# EasyEDA Pro project U-blox ZED F9P定位模块 差分GPS RTK定位.epro

# Schematic Schematic1

## Sheets
1 P1_GPS_F9P: Create Date: 2023-11-30; Page Name: P1; Project Name: U-blox ZED F9P定位模块 差分GPS RTK定位; Schematic Name: Schematic1; Update Date: 2023-11-30; Company: 嘉立创EDA; Page Size: A4; Version: V1.0
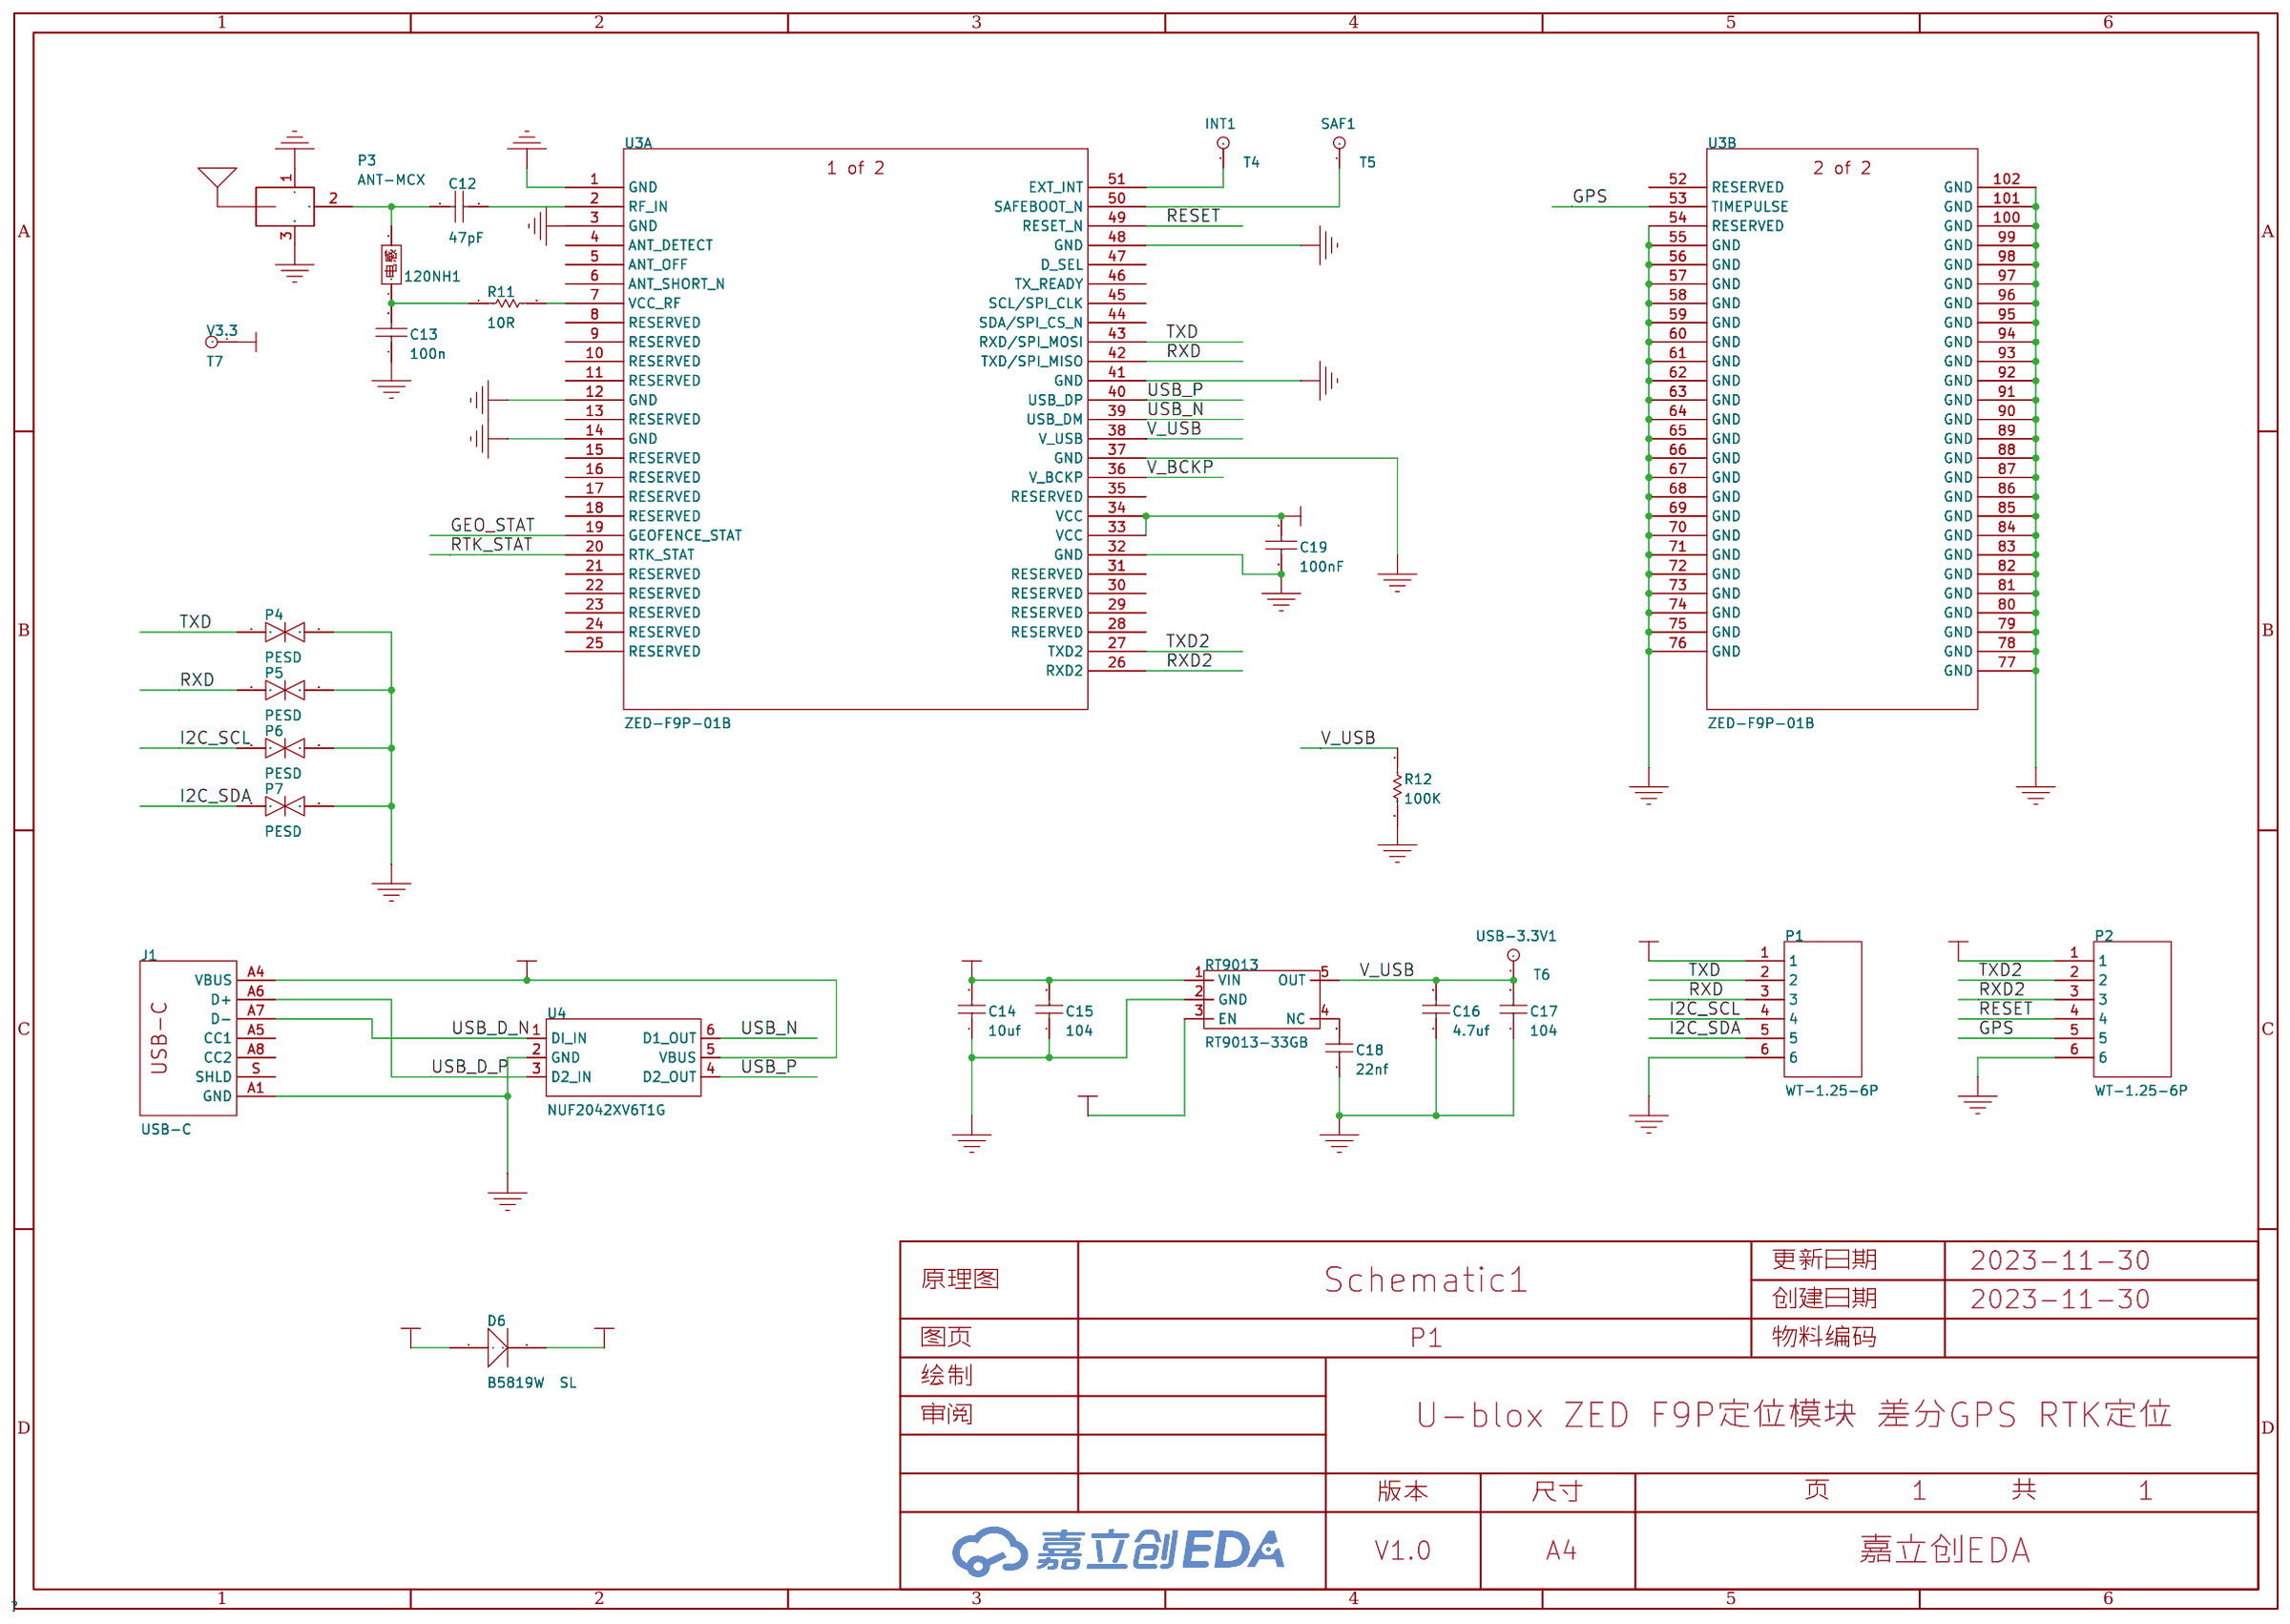
[diagram p0: P1_GPS_F9P]
2 P2_Power: Page Name: P2_Power
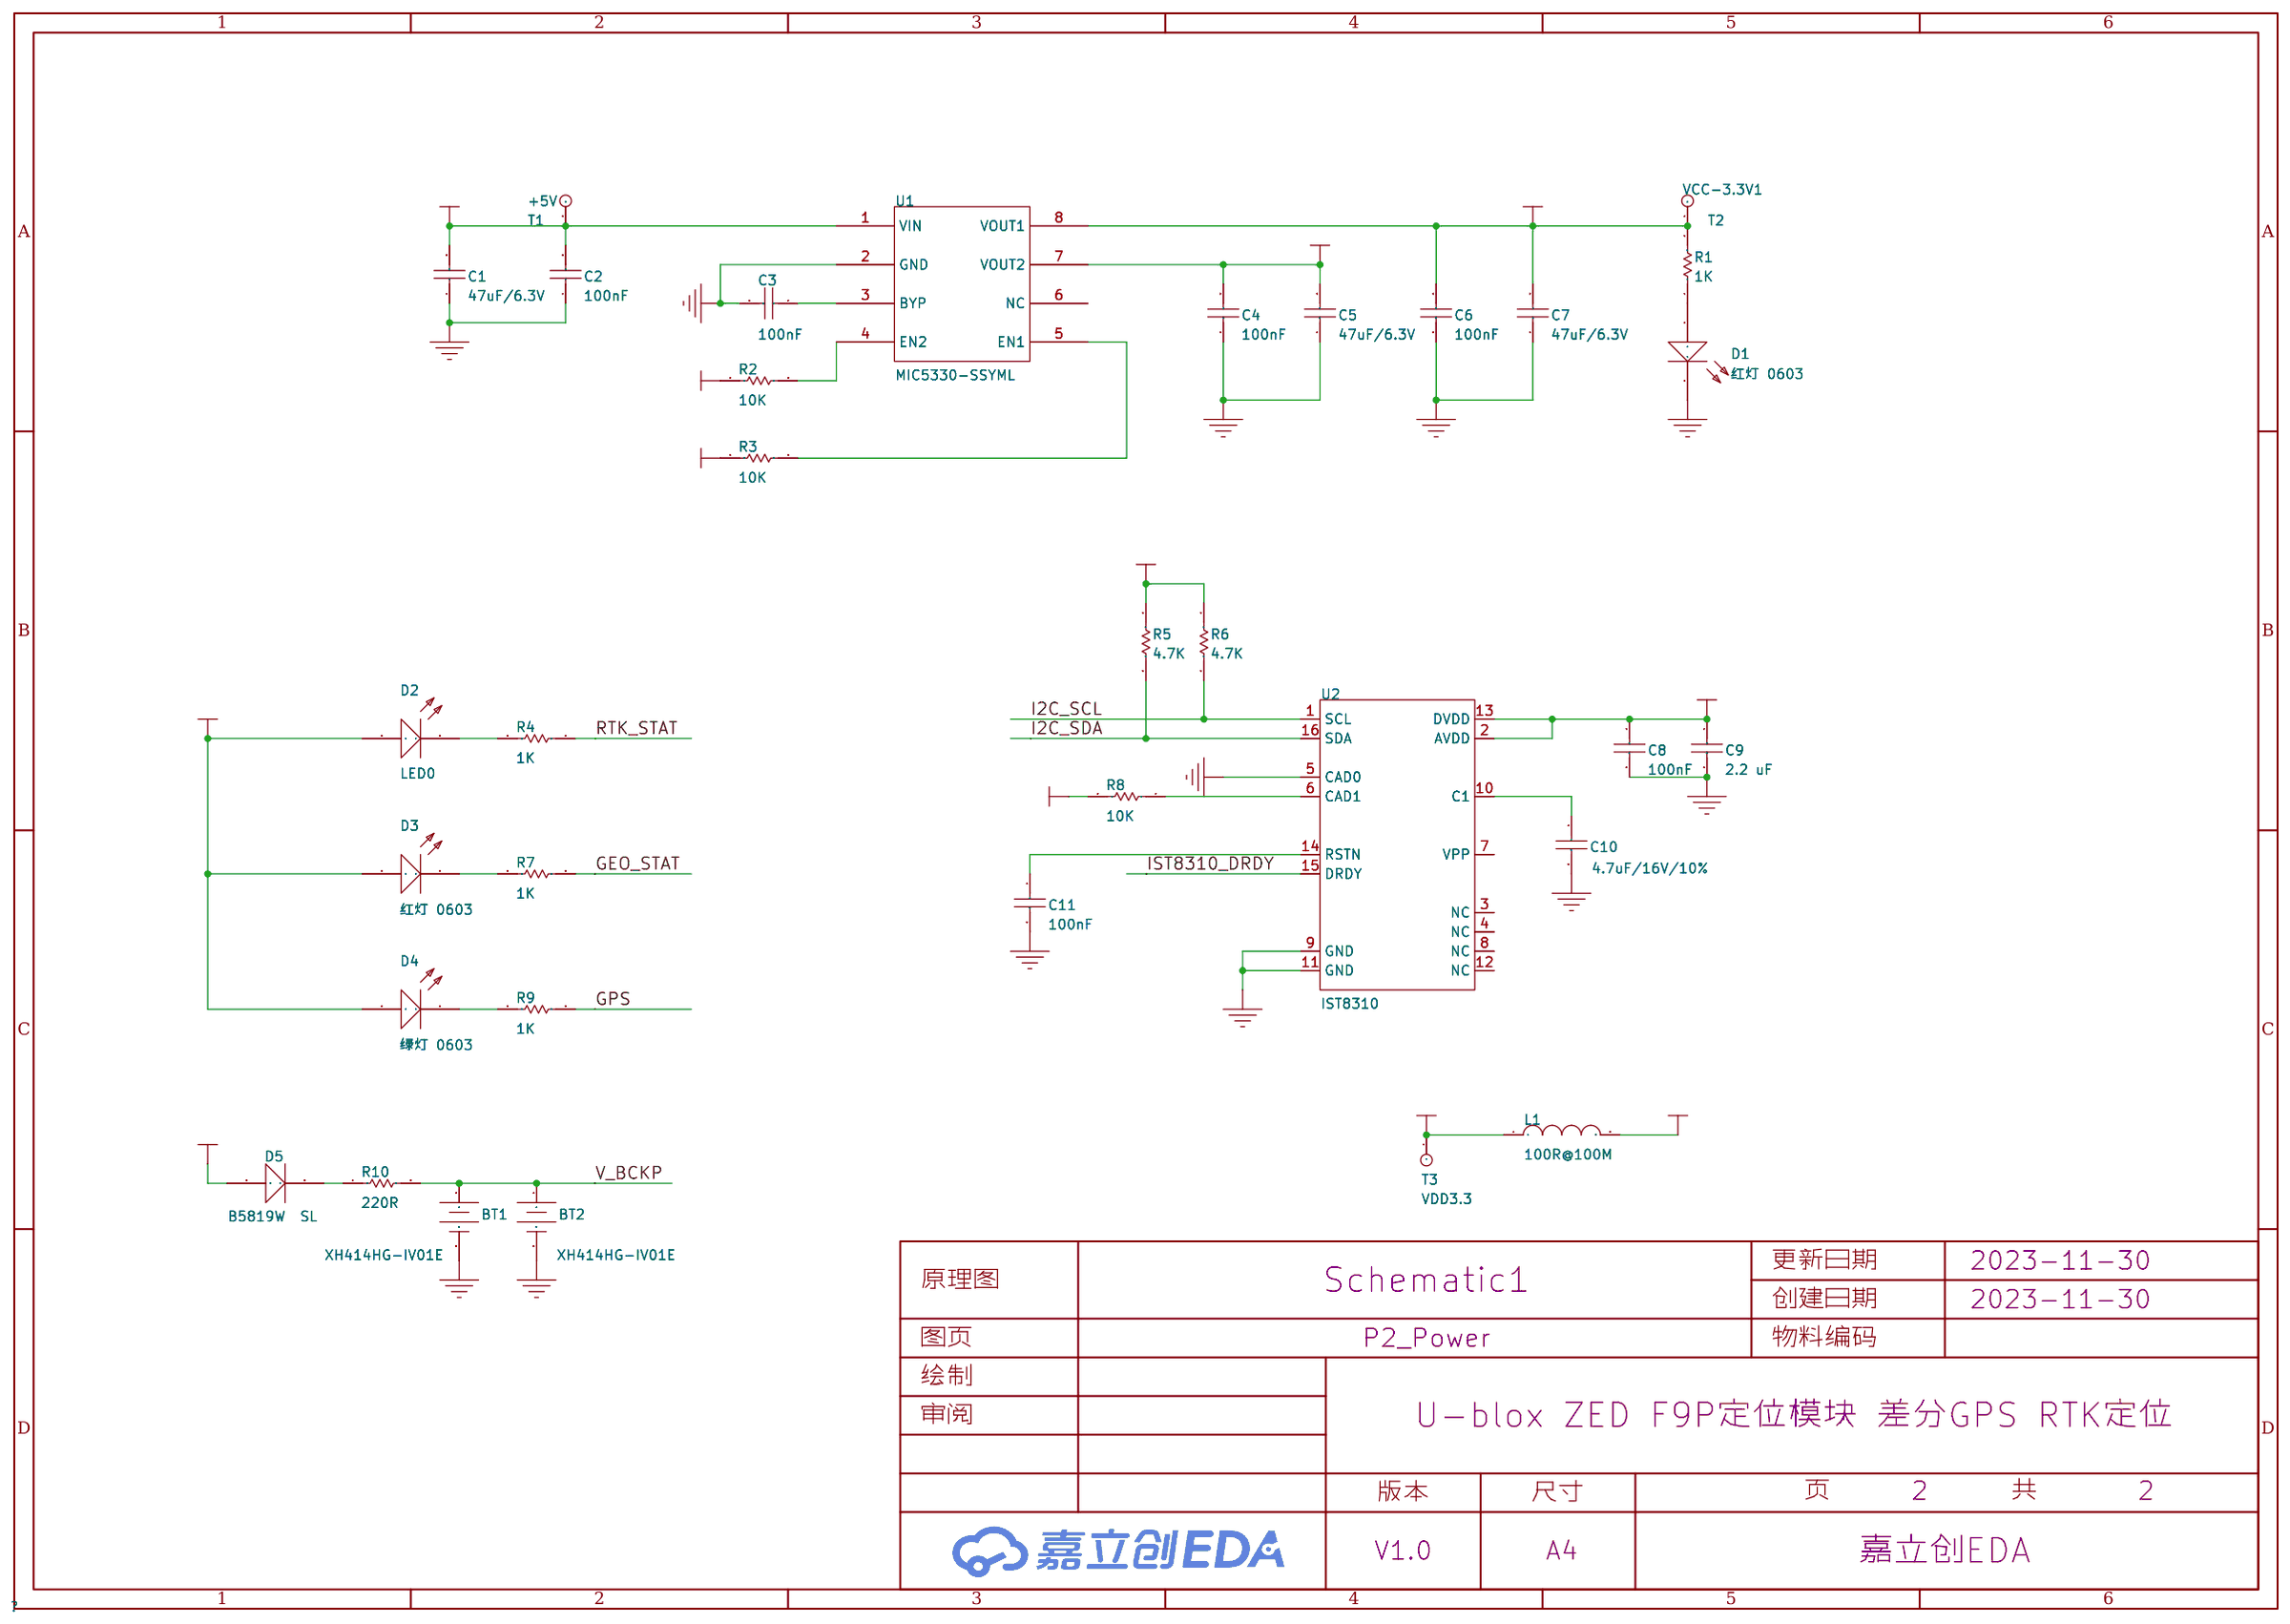
[diagram p1: P2_Power]

## Parts
sheet P1_GPS_F9P
120NH1  L  [0402R]
C12  100pF  [0402c]
C13  100pF  [0402c]
C14  10uf  [0603C]
C15  104  [0402c]
C16  4.7uf  [0603C]
C17  104  [0402c]
C18  22nf  [0402c]
C19  100pF  [0402c]
D6  B5819W  SL  [SOD-123]
INT1  T4  [TP]
J1  USB-C  [USB-Type-C]
P1  WT-1.25-6P  [GH-1.25-6P]
P2  WT-1.25-6P  [GH-1.25-6P]
P3  ANT-MCX  [ANT-MCX]
P4  PESD  [PESD0402]
P5  PESD  [PESD0402]
P6  PESD  [PESD0402]
P7  PESD  [PESD0402]
R11  1K  [0402R]
R12  1K  [0402R]
RT9013  RT9013-33GB  [SOT23-5L]
SAF1  T5  [TP]
U3  ZED-F9P-01B  [ZED-F9P-01B_UBL]  (sections 1,2)
U4  NUF2042XV6T1G  [SOT-563-6]
USB-3.3V1  T6  [TP]
V3.3  T7  [TP]
sheet P2_Power
BT1  XH414HG-IV01E  [XH414HG-IV01E]
BT2  XH414HG-IV01E  [XH414HG-IV01E]
C1  100pF  [0805C]
C2  100pF  [0402c]
C3  100pF  [0402c]
C4  100pF  [0402c]
C5  100pF  [0805C]
C6  100pF  [0402c]
C7  100pF  [0805C]
C8  100pF  [0402c]
C9  100pF  [0603C]
C10  100pF  [0603C]
C11  100pF  [0402c]
D1  红灯 0603  [0603_LED_S1]
D2  LED0  [0603D]
D3  红灯 0603  [0603_LED_S1]
D4  绿灯 0603  [0603_LED_S1]
D5  B5819W  SL  [SOD-123]
L1  10mH  [0603L]
R1  1K  [0402R]
R2  1K  [0402R]
R3  1K  [0402R]
R4  1K  [0402R]
R5  1K  [0402R]
R6  1K  [0402R]
R7  1K  [0402R]
R8  1K  [0402R]
R9  1K  [0402R]
R10  1K  [0402R]
T1  +5V  [TP]
T3  VDD3.3  [TP]
U1  MIC5330-SSYML  [MIC5330-SSYML-TR]
U2  IST8310  [LGA16-ITS8310]
VCC-3.3V1  T2  [TP]

## Library data of the parts
120NH1 = L: Library Name: Schlib1
C12 = 47pF: Capacitor; Published: 8-Jun-2000; LatestRevisionDate: 17-Jul-2002; LatestRevisionNote: Re-released for DXP Platform.; PackageReference: RAD-0.3; Publisher: Altium Limited; PackageDescription: Radial Cap, Thru-Hole; 2 Leads; 0.3 in Pin Spacing; Design Item ID: Cap; Library Name: Miscellaneous Devices
C13 = 100n: Capacitor; Published: 8-Jun-2000; LatestRevisionDate: 17-Jul-2002; LatestRevisionNote: Re-released for DXP Platform.; PackageReference: RAD-0.3; Publisher: Altium Limited; PackageDescription: Radial Cap, Thru-Hole; 2 Leads; 0.3 in Pin Spacing; Design Item ID: Cap; Library Name: Miscellaneous Devices
C14 = 10uf: 无极性电容; Design Item ID: CAP; Library Name: H750_CORE
C15 C17 = 104: 无极性电容; Design Item ID: CAP; Library Name: H750_CORE
C16 = 4.7uf: 无极性电容; Design Item ID: CAP; Library Name: H750_CORE
C18 = 22nf: 无极性电容; Design Item ID: CAP; Library Name: H750_CORE
C2-C4 C6 C8 C11 C19 = 100nF: Capacitor; Published: 8-Jun-2000; LatestRevisionDate: 17-Jul-2002; LatestRevisionNote: Re-released for DXP Platform.; PackageReference: RAD-0.3; Publisher: Altium Limited; PackageDescription: Radial Cap, Thru-Hole; 2 Leads; 0.3 in Pin Spacing; Origin Footprint 2: 0603C; Design Item ID: Cap; Library Name: Miscellaneous Devices
D5 D6 = B5819W  SL: 肖特基二极管; ComponentLink1Description: 供应商链接; ComponentLink1URL: http://www.szlcsc.com/product/details_9093.html; Supplier: LC; SuppliersPartNumber: C8598; Design Item ID: SOD-123 B5819W  SL; Library Name: Miscellaneous Devices LC
INT1 = T4: Library Name: Schlib1
J1 = USB-C: Design Item ID: USB3.1; Library Name: Schlib1
P1 P2 = WT-1.25-6P: Library Name: Schlib1
P3 = ANT-MCX: Design Item ID: ANT; Library Name: Schlib1
P4-P7 = PESD: PESD 0402; Library Name: Schlib1
R11 = 10R: Resistor; Published: 8-Jun-2000; LatestRevisionDate: 17-Jul-2002; LatestRevisionNote: Re-released for DXP Platform.; PackageReference: AXIAL-0.3; Publisher: Altium Limited; PackageDescription: Axial Device, Thru-Hole; 2 Leads; 0.3 in Pin Spacing; Design Item ID: Res1; Library Name: Miscellaneous Devices
R12 = 100K: Resistor; Published: 8-Jun-2000; LatestRevisionDate: 17-Jul-2002; LatestRevisionNote: Re-released for DXP Platform.; PackageReference: AXIAL-0.3; Publisher: Altium Limited; PackageDescription: Axial Device, Thru-Hole; 2 Leads; 0.3 in Pin Spacing; Design Item ID: Res1; Library Name: Miscellaneous Devices
RT9013 = RT9013-33GB: 3.3V 500mA LDO; Library Name: Schlib1
SAF1 = T5: Library Name: Schlib1
U3 = ZED-F9P-01B: 多频 GNSS 接收机; Copyright: Copyright (C) 2022 Ultra Librarian. All rights reserved.; Mfr_Name: Ublox; Manufacturer_Part_Number: ZED-F9R-01B; Type: DEV; Library Name: Schlib1
U4 = NUF2042XV6T1G: Library Name: Schlib1
USB-3.3V1 = T6: Library Name: Schlib1
V3.3 = T7: Library Name: Schlib1
BT1 BT2 = XH414HG-IV01E: Design Item ID: Battery; Library Name: Schlib1
C1 C5 C7 = 47uF/6.3V: Capacitor; Published: 8-Jun-2000; LatestRevisionDate: 17-Jul-2002; LatestRevisionNote: Re-released for DXP Platform.; PackageReference: RAD-0.3; Publisher: Altium Limited; PackageDescription: Radial Cap, Thru-Hole; 2 Leads; 0.3 in Pin Spacing; Origin Footprint 2: 1206C; Design Item ID: Cap; Library Name: Miscellaneous Devices
C9 = 2.2 uF: Capacitor; Published: 8-Jun-2000; LatestRevisionDate: 17-Jul-2002; LatestRevisionNote: Re-released for DXP Platform.; PackageReference: RAD-0.3; Publisher: Altium Limited; PackageDescription: Radial Cap, Thru-Hole; 2 Leads; 0.3 in Pin Spacing; Design Item ID: Cap; Library Name: Miscellaneous Devices
C10 = 4.7uF/16V/10%: Capacitor; Published: 8-Jun-2000; LatestRevisionDate: 17-Jul-2002; LatestRevisionNote: Re-released for DXP Platform.; PackageReference: RAD-0.3; Publisher: Altium Limited; PackageDescription: Radial Cap, Thru-Hole; 2 Leads; 0.3 in Pin Spacing; Design Item ID: Cap; Library Name: Miscellaneous Devices
D1 D3 = 红灯 0603: 发光二极管; ComponentLink1Description: 供应商链接; ComponentLink1URL: http://www.szlcsc.com/product/details_2659.html; Supplier: LC; SuppliersPartNumber: C2286; Design Item ID: 0603 红灯; Library Name: Miscellaneous Devices LC
D2 = LED0: Typical INFRARED GaAs LED; Published: 8-Jun-2000; LatestRevisionDate: 08-Jul-2005; LatestRevisionNote: Mech Layer 1 removed.; PackageReference: LED-0; Publisher: Altium Limited; PackageDescription: LED; 2 Leads; Library Name: Miscellaneous Devices
D4 = 绿灯 0603: 发光二极管; ComponentLink1Description: 供应商链接; ComponentLink1URL: http://www.szlcsc.com/product/details_73152.html; Supplier: LC; SuppliersPartNumber: C72043; Design Item ID: 0603 绿灯; Library Name: Miscellaneous Devices LC
L1 = 100R@100M: Inductor; Published: 8-Jun-2000; LatestRevisionDate: 29-May-2009; LatestRevisionNote: IPC-7351 Footprint Added.; PackageReference: 0402-A; Publisher: Altium Limited; PackageDescription: Chip Inductor; Code_JEITA: 0402; Code_IEC: 1005; Design Item ID: Inductor; Library Name: Miscellaneous Devices
R1 R4 = 1K: Resistor; Published: 8-Jun-2000; LatestRevisionDate: 17-Jul-2002; LatestRevisionNote: Re-released for DXP Platform.; PackageReference: AXIAL-0.3; Publisher: Altium Limited; PackageDescription: Axial Device, Thru-Hole; 2 Leads; 0.3 in Pin Spacing; Design Item ID: Res1; Library Name: Miscellaneous Devices
R2 R3 R8 = 10K: Resistor; Published: 8-Jun-2000; LatestRevisionDate: 17-Jul-2002; LatestRevisionNote: Re-released for DXP Platform.; PackageReference: AXIAL-0.3; Publisher: Altium Limited; PackageDescription: Axial Device, Thru-Hole; 2 Leads; 0.3 in Pin Spacing; Design Item ID: Res1; Library Name: Miscellaneous Devices
R5 R6 = 4.7K: Resistor; Published: 8-Jun-2000; LatestRevisionDate: 17-Jul-2002; LatestRevisionNote: Re-released for DXP Platform.; PackageReference: AXIAL-0.3; Publisher: Altium Limited; PackageDescription: Axial Device, Thru-Hole; 2 Leads; 0.3 in Pin Spacing; Design Item ID: Res1; Library Name: Miscellaneous Devices
R7 R9 = 1K: Resistor; Published: 8-Jun-2000; LatestRevisionDate: 17-Jul-2002; LatestRevisionNote: Re-released for DXP Platform.; PackageReference: AXIAL-0.3; Publisher: Altium Limited; PackageDescription: Axial Device, Thru-Hole; 2 Leads; 0.3 in Pin Spacing; Design Item ID: Res1; Library Name: Miscellaneous Devices; Origin Footprint 2: 0603R
R10 = 220R: Resistor; Published: 8-Jun-2000; LatestRevisionDate: 17-Jul-2002; LatestRevisionNote: Re-released for DXP Platform.; PackageReference: AXIAL-0.3; Publisher: Altium Limited; PackageDescription: Axial Device, Thru-Hole; 2 Leads; 0.3 in Pin Spacing; Design Item ID: Res1; Library Name: Miscellaneous Devices
T1 = +5V: Library Name: fly_controler
T3 = VDD3.3: Library Name: Schlib1
U1 = MIC5330-SSYML: Origin Footprint 2: MLF-8; Library Name: fly_controler
U2 = IST8310: Origin Footprint 2: QFN-16; Library Name: fly_controler
VCC-3.3V1 = T2: Library Name: Schlib1

## Nets
GND: BT1.2 BT2.2 C1.1 C2.1 C3.2 C4.1 C5.1 C6.1 C7.1 C8.2 C9.2 C10.2 C11.2 C13.1 C14.1 C15.1 C16.1 C17.1 C18.1 C19.2 D1.K J1.A1(GND) P1.6 P2.6 P3.1 P3.3 P4.2 P5.2 P6.2 P7.2 R12.2 RT9013.2(GND) U1.2(GND) U2.5(CAD0) U2.9(GND) U2.11(GND) U3.1(GND) U3.3(GND) U3.12(GND) U3.14(GND) U3.32(GND) U3.37(GND) U3.41(GND) U3.48(GND) U3.54(RESERVED) U3.55(GND) U3.56(GND) U3.57(GND) U3.58(GND) U3.59(GND) U3.60(GND) U3.61(GND) U3.62(GND) U3.63(GND) U3.64(GND) U3.65(GND) U3.66(GND) U3.67(GND) U3.68(GND) U3.69(GND) U3.70(GND) U3.71(GND) U3.72(GND) U3.73(GND) U3.74(GND) U3.75(GND) U3.76(GND) U3.77(GND) U3.78(GND) U3.79(GND) U3.80(GND) U3.81(GND) U3.82(GND) U3.83(GND) U3.84(GND) U3.85(GND) U3.86(GND) U3.87(GND) U3.88(GND) U3.89(GND) U3.90(GND) U3.91(GND) U3.92(GND) U3.93(GND) U3.94(GND) U3.95(GND) U3.96(GND) U3.97(GND) U3.98(GND) U3.99(GND) U3.100(GND) U3.101(GND) U3.102(GND) U4.2(GND)
VBUS: C14.2 C15.2 D6.1(A) J1.A4(VBUS) RT9013.1(VIN) U4.5(VBUS)
VCC_3V3: C6.2 C7.2 C19.1 D2.1(A) D3.A D4.A R1.2 R2.1 RT9013.3(EN) U1.8(VOUT1) U3.33(VCC) U3.34(VCC) V3.3.1 VCC-3.3V1.1
VDD_3V3: C4.2 C5.2 D5.1(A) L1.1 T3.1 U1.7(VOUT2)
VDD_5V_IN: C1.2 C2.2 D6.2(K) P1.1 P2.1 R3.1 T1.1 U1.1(VIN)
GEO_STAT: R7.2 U3.19(GEOFENCE_STAT)
GPS: P2.5 R9.2 U3.53(TIMEPULSE)
I2C_SCL: P1.4 P6.1 R6.2 U2.1(SCL)
I2C_SDA: P1.5 P7.1 R5.2 U2.16(SDA)
IST8310_DRDY: U2.15(DRDY)
RESET: P2.4 U3.49(RESET_N)
RTK_STAT: R4.1 U3.20(RTK_STAT)
RXD: P1.3 P5.1 U3.42(TXD/SPI_MISO)
RXD2: P2.3 U3.26(RXD2)
SEN_3V3: C8.1 C9.1 L1.2 R5.1 R6.1 R8.2 U2.2(AVDD) U2.13(DVDD)
TXD: P1.2 P4.1 U3.43(RXD/SPI_MOSI)
TXD2: P2.2 U3.27(TXD2)
USB_D_N: J1.A7(D-) U4.1(DI_IN)
USB_D_P: J1.A6(D+) U4.3(D2_IN)
USB_N: U3.39(USB_DM) U4.6(D1_OUT)
USB_P: U3.40(USB_DP) U4.4(D2_OUT)
V_BCKP: BT1.1 BT2.1 R10.2 U3.36(V_BCKP)
V_USB: C16.2 C17.2 R12.1 RT9013.5(OUT) U3.38(V_USB) USB-3.3V1.1
Net-(120NH1-1): 120NH1.1 C13.2 R11.1
Net-(120NH1-2): 120NH1.2 C12.1 P3.2
Net-(INT1-1): INT1.1 U3.51(EXT_INT)
Net-(SAF1-1): SAF1.1 U3.50(SAFEBOOT_N)
NETC3_1: C3.1 U1.3(BYP)
NETC10_1: C10.1 U2.10(C1)
NETC11_1: C11.1 U2.14(RSTN)
NETC12_2: C12.2 U3.2(RF_IN)
NETC18_2: C18.2 RT9013.4(NC)
NETD1_A: D1.A R1.1
NETD2_2: D2.2(K) R4.2
NETD3_K: D3.K R7.1
NETD4_K: D4.K R9.1
NETD5_2: D5.2(K) R10.1
NETR2_2: R2.2 U1.4(EN2)
NETR3_2: R3.2 U1.5(EN1)
NETR8_1: R8.1 U2.6(CAD1)
NETR11_2: R11.2 U3.7(VCC_RF)

Not connected (* = marked no-connect by the designer): J1 A5(CC1) A8(CC2) S(SHLD); U1 6(NC); U2 3(NC) 4(NC) 7(VPP) 8(NC) 12(NC); U3 4(ANT_DETECT) 5(ANT_OFF) 6(ANT_SHORT_N) 8(RESERVED) 9(RESERVED) 10(RESERVED) 11(RESERVED) 13(RESERVED) 15(RESERVED) 16(RESERVED) 17(RESERVED) 18(RESERVED) 21(RESERVED) 22(RESERVED) 23(RESERVED) 24(RESERVED) 25(RESERVED) 28(RESERVED) 29(RESERVED) 30(RESERVED) 31(RESERVED) 35(RESERVED) 44(SDA/SPI_CS_N) 45(SCL/SPI_CLK) 46(TX_READY) 47(D_SEL) 52(RESERVED)

# Board PCB1
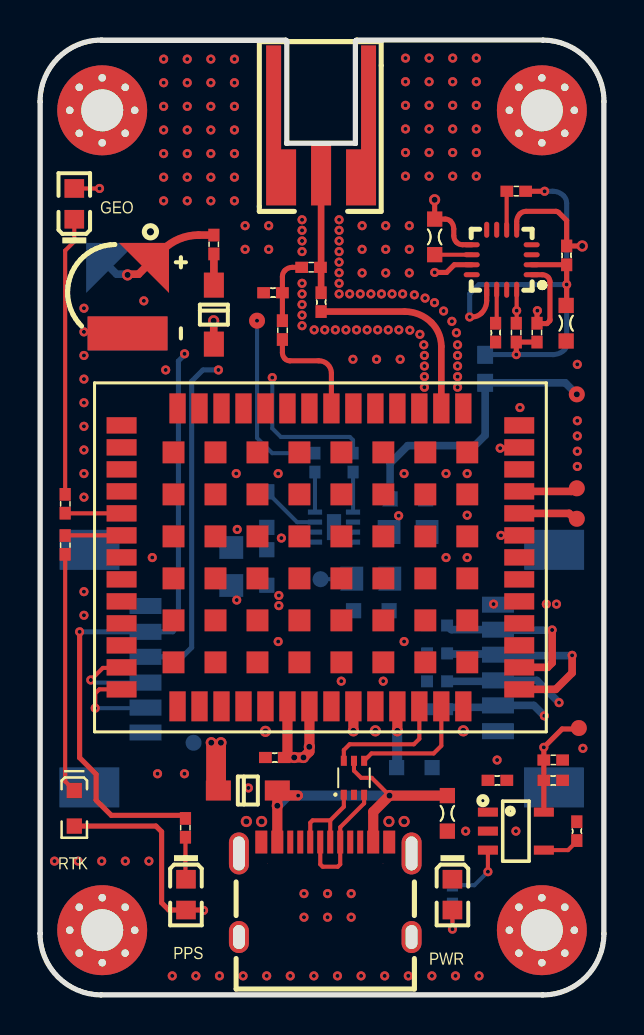
[diagram p2: board, top side]
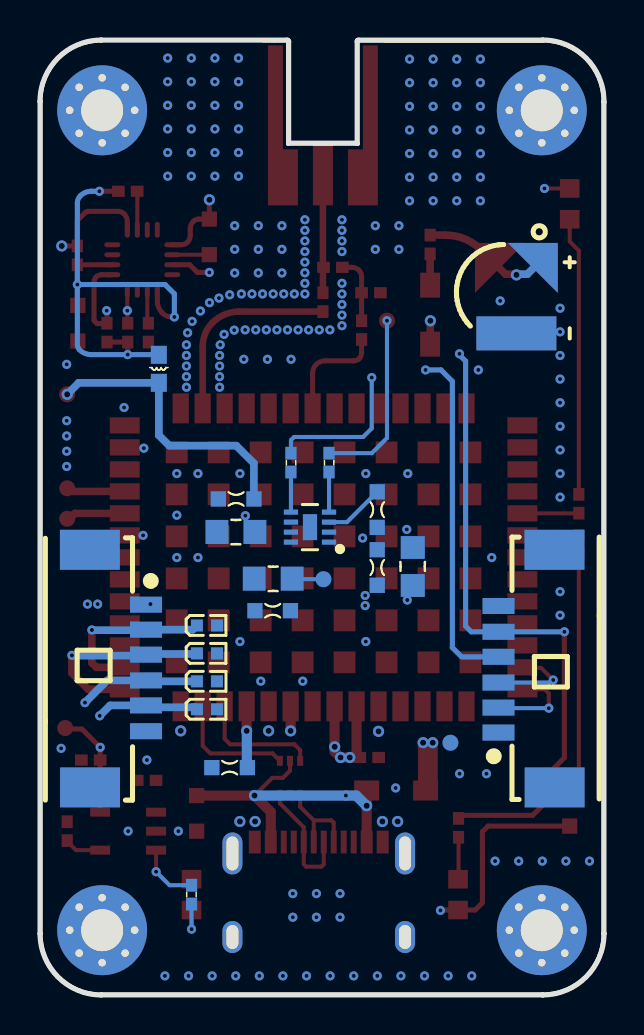
[diagram p3: board, bottom side, seen from below]

Outline 28.23 x 47.76 mm; copper layers: Top Layer, GND, Power, Bottom Layer. Coordinates in mm from the lower left corner of the outline.
Outline path: 0,3.07 0,3.09 ; 0,3.07 arc(0,3.08) 0,3.09 ; 0,3.07 arc(0.9,0.9) 3.06,0 arc(3.07,0) 3.07,0 25.14,0 arc(25.15,0) 25.16,0 arc(27.33,0.9) 28.22,3.06 arc(28.22,3.07) 28.22,3.07 28.22,44.67 arc(28.23,44.68) 28.23,44.69 arc(27.33,46.86) 25.16,47.76 arc(25.16,47.76) 25.16,47.76 15.86,47.76 arc(15.83,47.75) 15.81,47.74 15.8,47.72 arc(15.78,47.7) 15.78,47.68 15.78,42.6 12.36,42.6 12.36,47.68 arc(12.35,47.71) 12.34,47.73 12.33,47.74 arc(12.31,47.75) 12.28,47.76 3.09,47.76 arc(3.08,47.76) 3.07,47.76 arc(0.9,46.86) 0,44.69 arc(0,44.68) 0.01,44.67 arc(0,44.66) 0,44.64 0,3.09 ; 0.07,44.69 arc(0.95,46.82) 3.07,47.69 ; 0.07,3.07 0.07,44.64 ; 25.16,0.07 3.06,0.07 arc(0.94,0.95) 0.06,3.07 ; 10.99,47.69 3.07,47.69 12.28,47.69 12.29,47.68 12.29,42.54 15.84,42.54 15.84,47.68 15.86,47.69 17.09,47.69 ; 25.16,47.69 arc(27.28,46.81) 28.16,44.69 ; 28.16,44.69 28.16,3.06 ; 28.16,3.06 arc(27.28,0.94) 25.16,0.06
Stack: Top Layer 0.035mm / Dielectric1 1.51mm FR4 er 4.5 / GND 0.035mm / Dielectric2 0.48mm PP er 4.5 / Power 0.035mm / Dielectric3 0.48mm PP er 4.5 / Bottom Layer 0.035mm

## Design rules (mm)
template: JLCPCB Capability(Two Layers Board)
spacing copperThickness1oz (default): track to track 0.102, other pairs 0.152 to 0.3
spacing copperThickness2oz: track to track 0.203, other pairs 0.152 to 0.3
track width copperThickness1oz (default): min 0.127, default 0.254, max 2.54
track width copperThickness2oz: min 0.203, default 0.254, max 2.54
differential pair differentialPair (default): width min 0.127, default 0.254, max 2.54; gap min 0.152, default 0.152
via viaSize (default): diameter min 0.5, default 0.61, max 10; hole min 0.3, default 0.305, max 6.3

## Placement (name value [footprint] x y rotation side)
120NH  L  [0402R]  13.57 36.39 0 top
BT1  -  [XH414HG-IV01E]  4.77 35.12 180 bottom
BT2  -  [XH414HG-IV01E]  4 35.12 0 top
C1  100pF  [0805C]  9.57 21.43 270 bottom
C2  100pF  [0603C]  11.32 21.38 270 bottom
C3  100pF  [0603C]  11.32 24.27 270 bottom
C4  100pF  [0603C]  18.41 24.83 180 bottom
C5  100pF  [0805C]  18.42 23.16 180 bottom
C6  100pF  [0603C]  16.58 19.24 180 bottom
C7  100pF  [0805C]  16.56 20.82 180 bottom
C8  100pF  [0402c]  26.36 36.99 90 top
C9  100pF  [0603C]  26.36 33.59 270 top
C10  100pF  [0603C]  19.73 37.91 90 top
C11  100pF  [0402c]  22.8 33.12 270 top
C12  100pF  [0402c]  14.07 34.65 270 top
C13  100pF  [0402c]  11.66 35.12 0 top
C14  10uf  [0603C]  20.36 9.08 90 top
C15  104  [0402c]  22.89 10.73 180 top
C16  4.7uf  [0603C]  18.74 11.4 180 bottom
C17  104  [0402c]  25.68 10.73 180 top
C18  22nf  [0402c]  26.86 8.19 270 top
C19  100pF  [0402c]  11.75 11.88 180 top
D1  红灯 0603  [0603_LED_S1]  20.64 5.02 270 top
D2  LED0  [0603D]  1.72 9.34 90 top
D3  红灯 0603  [0603_LED_S1]  1.72 39.56 90 top
D4  绿灯 0603  [0603_LED_S1]  7.31 5.02 270 top
D5  B5819W  SL  [SOD-123]  8.7 34.02 270 top
D6  B5819W  SL  [SOD-123]  10.4 10.23 0 top
INT  T4  [TP]  26.86 25.34 90 top
J1  USB-C  [USB-Type-C]  14.28 5.27 0 top
L1  10mH  [0603L]  22.28 31.38 90 bottom
NOREF  -  [Pad_ie655]  4.26 45.39 270 top
NOREF#2  -  [Pad_ie672]  25.12 4.87 270 top
NOREF#3  -  [Pad_ie657]  4.26 43.09 270 top
NOREF#4  -  [Pad_ie665]  26.74 44.24 270 top
NOREF#5  -  [Pad_ie654]  3.12 45.87 270 top
NOREF#6  -  [Pad_ie674]  26.74 3.24 270 top
NOREF#7  -  [Pad_ie659]  1.97 43.09 270 top
NOREF#8  -  [Pad_ie660]  3.12 44.24 270 top
NOREF#9  -  [Pad_ie685]  3.12 1.62 270 top
NOREF#10  -  [Pad_ie661]  23.49 44.24 270 top
NOREF#11  -  [Pad_ie671]  23.97 4.39 270 top
NOREF#12  -  [Pad_ie653]  1.97 45.39 270 top
NOREF#13  -  [Pad_ie680]  1.97 4.39 270 top
NOREF#14  -  [Pad_ie682]  4.26 4.39 270 top
NOREF#15  -  [Pad_ie666]  26.26 43.09 270 top
NOREF#16  -  [Pad_ie673]  26.26 4.39 270 top
NOREF#17  -  [Pad_ie678]  25.12 3.24 270 top
NOREF#18  -  [Pad_ie684]  4.26 2.09 270 top
NOREF#19  -  [Pad_ie683]  4.74 3.24 270 top
NOREF#20  -  [Pad_ie656]  4.74 44.24 270 top
NOREF#21  -  [Pad_ie662]  23.97 45.39 270 top
NOREF#22  -  [Pad_ie687]  3.12 3.24 270 top
NOREF#23  -  [Pad_ie668]  23.97 43.09 270 top
NOREF#24  -  [Pad_ie681]  3.12 4.87 270 top
NOREF#25  -  [Pad_ie652]  1.49 44.24 270 top
NOREF#26  -  [Pad_ie664]  26.26 45.39 270 top
NOREF#27  -  [Pad_ie686]  1.97 2.09 270 top
NOREF#28  -  [Pad_ie670]  23.49 3.24 270 top
NOREF#29  -  [Pad_ie658]  3.12 42.62 270 top
NOREF#30  -  [Pad_ie676]  25.12 1.62 270 top
NOREF#31  -  [Pad_ie667]  25.12 42.62 270 top
NOREF#32  -  [Pad_ie675]  26.26 2.09 270 top
NOREF#33  -  [Pad_ie679]  1.49 3.24 270 top
NOREF#34  -  [Pad_ie669]  25.12 44.24 270 top
NOREF#35  -  [Pad_ie677]  23.97 2.09 270 top
NOREF#36  -  [Pad_ie663]  25.12 45.87 270 top
P1  WT-1.25-6P  [GH-1.25-6P]  24.32 16.32 270 bottom
P2  WT-1.25-6P  [GH-1.25-6P]  3.88 16.32 90 bottom
P3  -  [ANT-MCX]  14.03 43.99 270 top
P4  PESD  [PESD0402]  19.87 18.48 180 bottom
P5  PESD  [PESD0402]  19.87 17.08 180 bottom
P6  PESD  [PESD0402]  19.87 15.69 180 bottom
P7  PESD  [PESD0402]  19.87 14.29 180 bottom
R1  1K  [0402R]  20.64 5.02 90 bottom
R2  1K  [0402R]  13.76 26.62 270 bottom
R3  1K  [0402R]  15.67 26.62 270 bottom
R4  1K  [0402R]  1.26 22.51 270 top
R5  1K  [0402R]  23.84 33.12 90 top
R6  1K  [0402R]  24.87 33.12 90 top
R7  1K  [0402R]  1.26 24.57 270 top
R8  1K  [0402R]  23.83 40.19 0 top
R9  1K  [0402R]  7.28 8.36 90 top
R10  1K  [0402R]  8.7 37.53 90 top
R11  1K  [0402R]  12.13 33.25 270 top
R12  1K  [0402R]  25.68 11.75 0 top
RT9013  RT9013-33GB  [SOT23-5L]  23.82 8.19 270 top
SAF  T5  [TP]  26.86 23.82 90 top
T1  +5V  [TP]  7.69 12.61 0 bottom
T3  VDD3.3  [TP]  26.86 30.04 0 top
U1  MIC5330-SSYML  [MIC5330-SSYML-TR]  14.71 23.4 0 bottom
U2  IST8310  [LGA16-ITS8310]  23.11 36.77 180 top
U3  ZED-F9P-01B  [ZED-F9P-01B_UBL]  14.03 21.89 180 top
U4  NUF2042XV6T1G  [SOT-563-6]  15.71 10.86 90 top
USB-3.3V  T6  [TP]  26.97 13.35 90 top
V3.3  T7  [TP]  10.86 33.72 90 top
VCC-3.3V  T2  [TP]  14.04 20.79 270 bottom

## Footprints (pads in the part's own frame, mm; a bottom-side part is the same pattern mirrored in y, then rotated)
0402c
  rect 0.635x0.559 smd: 1(-0.471,0) 2(0.471,0)
0402R
  rect 0.635x0.559 smd: 1(-0.471,0) 2(0.471,0)
0603_LED_S1
  rect 0.93x0.98 smd: A(0.77,0) K(-0.77,0)
0603C
  rect 0.762x0.762 smd: 1(-0.889,-0.025) 2(0.889,-0.025)
0603D
  rect 0.762x0.762 smd: 1(-0.889,0) 2(0.889,0)
0603L
  rect 0.9x0.8 smd: 1(-0.763,0) 2(0.636,0)
0805C
  rect 1.14x1.2 smd: 1(-0.95,0) 2(0.95,0)
ANT-MCX
  rect 2x1 smd: 1(3.048,2.032) 3(3.048,-1.948)
  rect 3.2x1 smd: 2(2.907,0.042)
GH-1.25-6P
  rect 2x3 smd: 0(-5.942,-1.405) 0(5.942,-1.397)
  rect 0.8x1.6 smd: 1(-3.199,1.405) 2(-1.949,1.405) 3(-0.699,1.405) 4(0.591,1.405) 5(1.841,1.405) 6(3.131,1.405)
LGA16-ITS8310
  oval 0.8x0.25 smd: 1(-1.5,0.75) 2(-1.5,0.25) 3(-1.5,-0.25) 4(-1.5,-0.75) 9(1.5,-0.75) 10(1.5,-0.25) 11(1.5,0.25) 12(1.5,0.75)
  oval 0.25x0.8 smd: 5(-0.75,-1.5) 6(-0.25,-1.5) 7(0.25,-1.5) 8(0.75,-1.5) 13(0.75,1.5) 14(0.25,1.5) 15(-0.25,1.5) 16(-0.75,1.5)
MIC5330-SSYML-TR
  rect 0.711x0.254 smd: 1(-0.953,0.75) 2(-0.953,0.25) 3(-0.953,-0.25) 4(-0.953,-0.75) 5(0.953,-0.75) 6(0.953,-0.25) 7(0.953,0.25) 8(0.953,0.75)
  rect 0.711x1.296 smd: 9(0,0)
Pad_ie652
  round 0.762 hole 0.381: 0(0,0)
Pad_ie653
  round 0.762 hole 0.381: 0(0,0)
Pad_ie654
  round 0.762 hole 0.381: 0(0,0)
Pad_ie655
  round 0.762 hole 0.381: 0(0,0)
Pad_ie656
  round 0.762 hole 0.381: 0(0,0)
Pad_ie657
  round 0.762 hole 0.381: 0(0,0)
Pad_ie658
  round 0.762 hole 0.381: 0(0,0)
Pad_ie659
  round 0.762 hole 0.381: 0(0,0)
Pad_ie660
  round 4.5 hole 2.1: 1(0,0)
Pad_ie661
  round 0.762 hole 0.381: 0(0,0)
Pad_ie662
  round 0.762 hole 0.381: 0(0,0)
Pad_ie663
  round 0.762 hole 0.381: 0(0,0)
Pad_ie664
  round 0.762 hole 0.381: 0(0,0)
Pad_ie665
  round 0.762 hole 0.381: 0(0,0)
Pad_ie666
  round 0.762 hole 0.381: 0(0,0)
Pad_ie667
  round 0.762 hole 0.381: 0(0,0)
Pad_ie668
  round 0.762 hole 0.381: 0(0,0)
Pad_ie669
  round 4.5 hole 2.1: 1(0,0)
Pad_ie670
  round 0.762 hole 0.381: 0(0,0)
Pad_ie671
  round 0.762 hole 0.381: 0(0,0)
Pad_ie672
  round 0.762 hole 0.381: 0(0,0)
Pad_ie673
  round 0.762 hole 0.381: 0(0,0)
Pad_ie674
  round 0.762 hole 0.381: 0(0,0)
Pad_ie675
  round 0.762 hole 0.381: 0(0,0)
Pad_ie676
  round 0.762 hole 0.381: 0(0,0)
Pad_ie677
  round 0.762 hole 0.381: 0(0,0)
Pad_ie678
  round 4.5 hole 2.1: 1(0,0)
Pad_ie679
  round 0.762 hole 0.381: 0(0,0)
Pad_ie680
  round 0.762 hole 0.381: 0(0,0)
Pad_ie681
  round 0.762 hole 0.381: 0(0,0)
Pad_ie682
  round 0.762 hole 0.381: 0(0,0)
Pad_ie683
  round 0.762 hole 0.381: 0(0,0)
Pad_ie684
  round 0.762 hole 0.381: 0(0,0)
Pad_ie685
  round 0.762 hole 0.381: 0(0,0)
Pad_ie686
  round 0.762 hole 0.381: 0(0,0)
Pad_ie687
  round 4.5 hole 2.1: 1(0,0)
PESD0402
  rect 0.6x0.6 smd: 1(-0.501,-0.002) 2(0.501,-0.002)
SOD-123
  rect 1.25x1 smd: 1(1.475,0) 2(-1.475,0)
SOT23-5L
  rect 0.45x1 smd: 1(-0.95,-1.4) 2(0,-1.4) 3(0.95,-1.4) 4(0.95,1.4) 5(-0.95,1.4)
SOT-563-6
  rect 0.5x0.3 smd: 1(-0.85,0.508) 2(-0.85,0) 3(-0.85,-0.508) 4(0.85,-0.508) 5(0.85,0) 6(0.85,0.508)
TP
  round 0.8 smd: 1(0,0)
USB-Type-C
  round 0.013 hole 0.65: 1(2.89,1.305) 2(-2.89,1.305)
  rect 0.6x1.14 smd: A1(-3.2,2.375) A1(3.2,2.375) A4(-2.4,2.375) A4(2.4,2.375)
  rect 0.3x1.14 smd: A5(-1.25,2.375) A5(1.75,2.375) A6(-0.25,2.375) A6(0.75,2.375) A7(-0.75,2.375) A7(0.25,2.375) A8(-1.75,2.375) A8(1.25,2.375)
  oval 1x2.1 hole 0.6x1.7: S(-4.32,1.805) S(4.32,1.805)
  oval 1x1.6 hole 0.6x1.2: S(-4.32,-2.375) S(4.32,-2.375)
XH414HG-IV01E
  round 0.508 smd: 1(1.778,1.778)
  rect 4x1.7 smd: 2(0.381,-2.032)
ZED-F9P-01B_UBL
  rect 0.813x1.498 smd: 1(-7.15,-7.45) 2(-6.05,-7.45) 3(-4.95,-7.45) 4(-3.85,-7.45) 5(-2.75,-7.45) 6(-1.65,-7.45) 7(-0.55,-7.45) 8(0.55,-7.45) 9(1.65,-7.45) 10(2.75,-7.45) 11(3.85,-7.45) 12(4.95,-7.45) 13(6.05,-7.45) 14(7.15,-7.45) 28(7.15,7.45) 29(6.05,7.45) 30(4.95,7.45) 31(3.85,7.45) 32(2.75,7.45) 33(1.65,7.45) 34(0.55,7.45) 35(-0.55,7.45) 36(-1.65,7.45) 37(-2.75,7.45) 38(-3.85,7.45) 39(-4.95,7.45) 40(-6.05,7.45) 41(-7.15,7.45)
  rect 1.498x0.813 smd: 15(9.95,-6.6) 16(9.95,-5.5) 17(9.95,-4.4) 18(9.95,-3.3) 19(9.95,-2.2) 20(9.95,-1.1) 21(9.95,0) 22(9.95,1.1) 23(9.95,2.2) 24(9.95,3.3) 25(9.95,4.4) 26(9.95,5.5) 27(9.95,6.6) 42(-9.95,6.6) 43(-9.95,5.5) 44(-9.95,4.4) 45(-9.95,3.3) 46(-9.95,2.2) 47(-9.95,1.1) 48(-9.95,0) 49(-9.95,-1.1) 50(-9.95,-2.2) 51(-9.95,-3.3) 52(-9.95,-4.4) 53(-9.95,-5.5) 54(-9.95,-6.6)
  rect 1.092x1.092 smd: 55(-7.35,-5.25) 56(-7.35,-3.15) 57(-7.35,-1.05) 58(-7.35,1.05) 59(-7.35,3.15) 60(-7.35,5.25) 61(-5.25,-5.25) 62(-5.25,-3.15) 63(-5.25,-1.05) 64(-5.25,1.05) 65(-5.25,3.15) 66(-5.25,5.25) 67(-3.15,-5.25) 68(-3.15,-3.15) 69(-3.15,-1.05) 70(-3.15,1.05) 71(-3.15,3.15) 72(-3.15,5.25) 73(-1.05,-5.25) 74(-1.05,-3.15) 75(-1.05,-1.05) 76(-1.05,1.05) 77(-1.05,3.15) 78(-1.05,5.25) 79(1.05,-5.25) 80(1.05,-3.15) 81(1.05,-1.05) 82(1.05,1.05) 83(1.05,3.15) 84(1.05,5.25) 85(3.15,-5.25) 86(3.15,-3.15) 87(3.15,-1.05) 88(3.15,1.05) 89(3.15,3.15) 90(3.15,5.25) 91(5.25,-5.25) 92(5.25,-3.15) 93(5.25,-1.05) 94(5.25,1.05) 95(5.25,3.15) 96(5.25,5.25) 97(7.35,-5.25) 98(7.35,-3.15) 99(7.35,-1.05) 100(7.35,1.05) 101(7.35,3.15) 102(7.35,5.25)

## Nets
As in the schematic, except:
GND: BT1.2 BT2.2 C1.1 C2.1 C3.2 C4.1 C5.1 C6.1 C7.1 C8.2 C9.2 C10.2 C11.2 C13.1 C14.1 C15.1 C16.1 C17.1 C18.1 C19.2 D1.K J1.A1 J1.S NOREF.0 NOREF#2.0 NOREF#3.0 NOREF#4.0 NOREF#5.0 NOREF#6.0 NOREF#7.0 NOREF#8.1 NOREF#9.0 NOREF#10.0 NOREF#11.0 NOREF#12.0 NOREF#13.0 NOREF#14.0 NOREF#15.0 NOREF#16.0 NOREF#17.1 NOREF#18.0 NOREF#19.0 NOREF#20.0 NOREF#21.0 NOREF#22.1 NOREF#23.0 NOREF#24.0 NOREF#25.0 NOREF#26.0 NOREF#27.0 NOREF#28.0 NOREF#29.0 NOREF#30.0 NOREF#31.0 NOREF#32.0 NOREF#33.0 NOREF#34.1 NOREF#35.0 NOREF#36.0 P1.6 P2.6 P3.1 P3.3 P4.2 P5.2 P6.2 P7.2 R12.2 RT9013.2 U1.2 U2.5 U2.9 U2.11 U3.1 U3.3 U3.12 U3.14 U3.32 U3.37 U3.41 U3.48 U3.54 U3.55 U3.56 U3.57 U3.58 U3.59 U3.60 U3.61 U3.62 U3.63 U3.64 U3.65 U3.66 U3.67 U3.68 U3.69 U3.70 U3.71 U3.72 U3.73 U3.74 U3.75 U3.76 U3.77 U3.78 U3.79 U3.80 U3.81 U3.82 U3.83 U3.84 U3.85 U3.86 U3.87 U3.88 U3.89 U3.90 U3.91 U3.92 U3.93 U3.94 U3.95 U3.96 U3.97 U3.98 U3.99 U3.100 U3.101 U3.102 U4.2
VCC_3V3: C6.2 C7.2 C19.1 D2.1 D3.A D4.A R1.2 R2.1 RT9013.3 U1.8 U3.33 U3.34 V3.3.1 VCC-3.3V.1
NET120NH_1: 120NH.1 C13.2 R11.1
NET120NH_2: 120NH.2 C12.1 P3.2
NETINT_1: INT.1 U3.51
NETSAF_1: SAF.1 U3.50
V_USB: C16.2 C17.2 R12.1 RT9013.5 U3.38 USB-3.3V.1

Pads without a net: J1 1 2 A5 A8; P1 0; P2 0; U1 6 9; U2 3 4 7 8 12; U3 4 5 6 8 9 10 11 13 15 16 17 18 21 22 23 24 25 28 29 30 31 35 44 45 46 47 52

## Via types
v1: diameter 0.559, hole 0.305, Top Layer to Bottom Layer, 21 vias
v2: diameter 0.457, hole 0.203, Top Layer to Bottom Layer, 217 vias

## Routing (per net, layer and track width the routed paths; a pad name or vN(x,y) marks a point on that pad's centre or on a via; arc(x,y) is an arc through that point)
GND: length 11.2
  Top Layer w0.254: v2(19.75,36.13) 20.35,36.13 20.73,36.52 U2.11 ; U2.9 21.15,37.52 arc(20.98,37.55) 20.84,37.65 arc(20.74,37.8) 20.71,37.97 20.71,38.31 arc(20.67,38.52) 20.55,38.7 arc(20.43,38.77) 20.29,38.8 C10.2 19.75,39.76 v1(19.75,39.77) ; v1(27.14,37.46) C8.2 26.36,38.73 25.96,39.13 arc(25.89,39.18) 25.82,39.19 24.32,39.19 arc(24.16,39.16) 24.02,39.06 arc(23.9,38.88) 23.86,38.67 U2.5
  vias: v1(10.33,8.68) v1(11.09,8.68) v1(11.28,13.18) v1(16.78,13.21) v1(17.46,8.68) v1(18.22,8.68) v1(21.18,13.21) v2(0.73,6.7) v2(1.91,6.7) v2(2.2,34.34) v2(2.2,33.16) v2(2.2,31.98) v2(2.2,30.8) v2(2.2,29.62) v2(2.2,28.44) v2(2.2,27.26) v2(2.2,26.08) v2(2.2,24.9) v2(2.2,20.17) v2(2.2,18.99) v2(3.09,6.7) v2(4.27,6.7) v2(5.2,34.71) v2(5.45,6.7) v2(5.62,21.88) v2(5.88,11.06) v2(6.19,46.8) v2(6.19,45.62) v2(6.19,44.44) v2(6.19,43.26) v2(6.19,42.08) v2(6.19,40.9) v2(6.19,39.72) v2(6.29,31.26) v2(6.62,0.96) v2(7.23,11.06) v2(7.37,46.8) v2(7.37,45.62) v2(7.37,44.44) v2(7.37,43.26) v2(7.37,42.08) v2(7.37,40.9) v2(7.37,39.72) v2(7.8,0.96) v2(8.55,46.8) v2(8.55,45.62) v2(8.55,44.44) v2(8.55,43.26) v2(8.55,42.08) v2(8.55,40.9) v2(8.55,39.72) v2(8.98,0.96) v2(9.73,46.8) v2(9.73,45.62) v2(9.73,44.44) v2(9.73,43.26) v2(9.73,42.08) v2(9.73,40.9) v2(9.73,39.72) v2(9.82,26.08) v2(9.87,23.28) v2(10.16,0.96) v2(10.27,38.47) v2(10.27,37.29) v2(10.43,10.35) v2(11.34,0.96) v2(11.45,38.47) v2(11.45,37.29) v2(11.92,26.08) v2(11.92,17.68) v2(12.08,22.85) v2(12.53,0.96) v2(13.12,38.77) v2(13.12,38.24) v2(13.12,37.71) v2(13.12,37.18) v2(13.12,35.59) v2(13.12,35.06) v2(13.12,34.53) v2(13.12,34) v2(13.12,33.47) v2(13.21,5.07) v2(13.21,3.89) v2(13.72,33.26) v2(13.71,0.96) v2(14.25,33.26) v2(14.39,5.07) v2(14.39,3.89) v2(14.78,33.26) v2(14.97,38.77) v2(14.97,38.24) v2(14.97,37.71) v2(14.97,37.18) v2(14.97,36.65) v2(14.97,36.12) v2(14.97,35.59) v2(14.97,35.06) v2(14.89,0.96) v2(15.08,15.7) v2(15.31,33.26) v2(15.5,35.06) v2(15.57,5.07) v2(15.57,3.89) v2(15.66,31.79) v2(15.84,33.26) v2(16.03,35.06) v2(16.07,0.96) v2(16.12,38.47) v2(16.12,37.29) v2(16.12,36.11) v2(16.37,33.26) v2(16.56,35.06) v2(16.84,31.79) v2(16.9,33.26) v2(17.09,35.06) v2(17.18,15.7) v2(17.25,0.96) v2(17.3,38.47) v2(17.3,37.29) v2(17.3,36.11) v2(17.43,33.26) v2(17.62,35.06) v2(17.96,33.26) v2(18.03,31.79) v2(18.15,35.06) v2(18.22,26.08) v2(18.22,17.68) v2(18.29,46.85) v2(18.29,45.67) v2(18.29,44.49) v2(18.29,43.31) v2(18.29,42.13) v2(18.29,40.95) v2(18.48,38.47) v2(18.48,37.29) v2(18.48,36.11) v2(18.43,0.96) v2(18.51,33.25) v2(18.73,35.01) v2(19.01,33.04) v2(19.27,34.85) v2(19.21,32.51) v2(19.24,31.98) v2(19.24,31.45) v2(19.24,30.92) v2(19.24,30.39) v2(19.47,46.85) v2(19.47,45.67) v2(19.47,44.49) v2(19.47,43.31) v2(19.47,42.13) v2(19.47,40.95) v2(19.61,0.96) v2(19.74,34.62) v2(20.2,34.21) v2(20.32,26.08) v2(20.32,21.88) v2(20.65,46.85) v2(20.65,45.67) v2(20.65,44.49) v2(20.65,43.31) v2(20.65,42.13) v2(20.65,40.95) v2(20.61,33.69) v2(20.84,33.12) v2(20.79,0.96) v2(20.9,32.51) v2(20.9,31.98) v2(20.9,31.45) v2(20.9,30.92) v2(20.9,30.39) v2(21.38,26.08) v2(21.38,23.99) v2(21.38,21.88) v2(21.3,8.19) v2(21.84,46.85) v2(21.84,45.67) v2(21.84,44.49) v2(21.84,43.31) v2(21.84,42.13) v2(21.84,40.95) v2(21.97,0.96) v2(22.88,11.75) v2(23.82,8.19) v2(24.02,29.38) v2(26.89,31.54) v2(26.89,28.72) v2(26.89,27.96) v2(26.89,27.19) v2(26.89,26.43) v2(27.17,12.33)
VBUS: length 17.5
  Top Layer w0.203: v1(17.49,9.97) 16.6,10.86 16.07,10.86 15.71,11.22 U4.5
  Top Layer w0.508: J1.A4 16.68,9.16 v1(17.49,9.97) C14.2 ; 11.88,7.65 v1(11.88,9.46) D6.1 ; 12.12,9.98 12.91,9.98
  Bottom Layer w0.508: v1(11.88,9.46) 11.89,9.46 12.4,9.97 v2(12.92,9.97) v1(17.49,9.97)
VCC_3V3: length 101.1
  Top Layer w0.203: D3.A v2(2.98,40.33) ; v2(22.42,6.17) RT9013.3
  Top Layer w0.254: D2.1 5.8,8.45 6.09,8.16 6.09,4.61 6.45,4.25 D4.A 8.17,4.25 v2(8.19,4.23)
  Top Layer w0.508: C19.1 12.26,11.88 ; 12.26,11.88 v1(12.72,11.88) v1(13.19,11.88) 13.48,12.18 U3.34 ; 12.26,11.88 12.38,12 U3.33
  Power w0.203: v2(2.98,40.33) 2.98,37.29 3.37,36.9 ; 3.37,36.9 3.37,11.55 4.65,10.27 8.19,10.27 ; 3.37,36.9 5.27,36.9 5.78,36.39 5.78,35.12 6.42,34.48 10.1,34.48 v2(10.86,33.72)
  Power w0.254: v1(12.72,11.88) 9.8,11.88 8.19,10.27 v2(8.19,4.23) ; v1(13.19,11.88) 21.53,11.88 22.42,10.99 v2(22.42,6.17)
  Bottom Layer w0.203: v2(22.42,6.17) 21.74,5.49 R1.2 ; VCC-3.3V.1 15.58,20.79 15.61,20.82 ; v2(10.86,33.72) 10.86,27.85 11.62,27.1 R2.1
  vias: v1(13.48,12.41)
VDD_3V3: length 40.4
  Top Layer w0.381: D5.1 8.7,32.56 8.7,33.71 v1(8.69,33.72)
  Power w0.381: v2(17.95,23.97) 5.98,23.97 5.55,24.4 5.55,33.1 6.17,33.72 v1(8.69,33.72)
  Bottom Layer w0.381: v1(26.86,30.04) 26.29,30.61 L1.1 22.28,27.99 21.76,27.47 18.41,27.47 17.52,26.59 C4.2
VDD_5V_IN: length 37
  Top Layer w0.508: 9.06,10.23 v1(9.06,12.62) ; 8.57,10.23 v1(8.57,12.62)
  Power w0.203: v2(22.7,19.55) 23.79,19.55 24.27,20.03 24.27,27.4 23.71,27.96 12,27.96 11.62,28.34 v2(11.62,30.88)
  Bottom Layer w0.203: R3.1 15.67,27.75 15.51,27.91 12.06,27.91 11.62,28.34 v2(11.62,30.88)
  vias: v2(9.85,19.75) v2(11.95,19.98) v2(11.95,19.47) v2(25.34,19.55) v2(25.85,19.55)
GEO_STAT: length 2.8
  Top Layer w0.203: R7.2 1.27,24.09 U3.19
GPS: length 53.2
  Top Layer w0.254: v2(23.03,27.35) 23.94,27.35 U3.53 ; v2(1.98,18.16) 1.98,11.87 2.81,11.04 2.81,9.74 3.57,8.98 7.13,8.98 7.28,8.83
  Power w0.254: v2(23.03,27.35) 10.07,27.35 9.77,27.65 9.77,31.21 8.91,32.07 v2(7.24,32.07)
  Bottom Layer w0.254: v2(1.98,18.16) P2.5 6.64,18.16 6.93,18.45 6.93,31.7 7.24,32.01 v2(7.24,32.07)
I2C_SCL: length 31.3
  Top Layer w0.254: U2.1 25.13,36.02 arc(25.29,35.99) 25.43,35.9 arc(25.5,35.79) 25.52,35.67 25.52,33.78 arc(25.52,33.75) 25.51,33.72 25.37,33.58 24.92,33.58 arc(24.89,33.58) R6.2 24.87,34.18 arc(24.88,34.2) v2(24.89,34.22)
  Power w0.203: v2(25.97,14.62) 25.97,17.18 26.92,18.13 26.92,20.18 25.85,21.25 25.85,32.45 24.89,33.41 v2(24.89,34.22)
  Bottom Layer w0.381: P6.1 22.87,15.69 P1.4 24.86,15.73 v2(25.97,14.62)
I2C_SDA: length 28.7
  Top Layer w0.203: U2.16 23.86,33.64 arc(23.85,33.62) R5.2
  Power w0.203: v2(25.24,13.96) 25.24,17.08 26.44,18.28 26.44,19.82 25.31,20.95 25.31,32.2 23.85,33.66 v2(23.85,34.22)
  Bottom Layer w0.381: 20.37,14.29 20.47,14.39 22.82,14.39 P1.5 24.72,14.48 v2(25.24,13.96)
NET120NH_1: length 3.4
  Top Layer w0.254: R11.1 C13.2 12.13,35.93 arc(12.17,36.1) 12.26,36.24 arc(12.43,36.35) 12.63,36.39 120NH.1
NET120NH_2: length 6
  Top Layer w0.33: C12.1 P3.2
NETC3_1: length 3
  Bottom Layer w0.203: C3.1 12.87,23.65 13.76,23.65
NETC10_1: length 1.9
  Top Layer w0.203: 19.75,37.02 19.76,37.02 U2.10
NETC11_1: length 1.7
  Top Layer w0.203: U2.14 22.86,33.73 arc(22.84,33.66) C11.1
NETC12_2: length 10.1
  Top Layer w0.33: C12.2 18.25,34.18 arc(18.98,34.03) 19.59,33.62 arc(19.96,33.08) 20.08,32.44 ; U3.2 20.08,32.44
NETC18_2: length 1.9
  Top Layer w0.203: RT9013.4 26.42,7.24 26.86,7.69 C18.2
NETD1_A: length 2.2
  Top Layer w0.203: v2(20.64,3.29) D1.A
  Bottom Layer w0.203: v2(20.64,3.29) R1.1
NETD2_2: length 12
  Top Layer w0.203: R4.2 1.26,10.68 D2.2
NETD3_K: length 13.9
  Top Layer w0.203: R7.1 1.26,37.23 1.72,37.68 D3.K
NETD4_K: length 2.1
  Top Layer w0.203: D4.K 7.28,5.82 R9.1
NETD5_2: length 1.6
  Top Layer w0.381: D5.2 R10.1
NETINT_1: length 2.9
  Top Layer w0.381: U3.51 26.6,25.19 26.75,25.34 INT.1
NETR2_2: length 2
  Bottom Layer w0.203: 13.76,24.15 R2.2
NETR3_2: length 2
  Bottom Layer w0.203: U1.5 R3.2
NETR8_1: length 1.9
  Top Layer w0.203: U2.6 23.36,40.19 R8.1
NETR11_2: length 5.5
  Top Layer w0.254: U3.7 14.58,31.09 arc(14.4,31.54) 13.94,31.72 12.5,31.72 arc(12.37,31.74) 12.26,31.82 arc(12.16,31.96) 12.13,32.12 R11.2
NETSAF_1: length 3
  Top Layer w0.381: U3.50 26.48,24.09 26.75,23.82 SAF.1
RESET: length 39.4
  Top Layer w0.254: v2(23.07,22.99) U3.49
  Power w0.254: v2(8.93,31.26) 8.93,25.31 9.54,24.7 18.74,24.7 20.46,22.99 v2(23.07,22.99)
  Bottom Layer w0.254: v2(8.93,31.26) 8.16,31.26 7.59,30.69 7.59,17.37 7.13,16.91 P2.4
RTK_STAT: length 2.8
  Top Layer w0.203: U3.20 1.27,22.99 R4.1
RXD: length 10.2
  Top Layer w0.381: U3.42 25.81,15.29 26.63,16.1 v2(26.63,16.99)
  Bottom Layer w0.381: 20.37,17.08 20.4,17.05 22.89,17.05 P1.3 22.97,16.97 26.62,16.97 v2(26.63,16.99)
RXD2: length 4.6
  Top Layer w0.203: U3.26 4.06,16.36 3.15,16.36 v2(2.54,15.75)
  Bottom Layer w0.203: P2.3 2.74,15.62 2.61,15.75 v2(2.54,15.75)
SEN_3V3: length 27.3
  Top Layer w0.254: v2(23.84,32.02) R5.1 R6.1 ; R8.2 v2(25.25,40.19) ; U2.2 26.35,36.52 C8.1 v2(26.36,35.53) 26.36,34.55 arc(26.35,34.51) C9.1 ; U2.13 22.36,34.72 arc(22.29,34.39) 22.1,34.1 arc(21.88,33.96) 21.63,33.91 v2(21.5,33.91)
  Bottom Layer w0.254: v2(21.5,33.91) 21.5,35.07 21.97,35.53 v2(26.36,35.53) ; 22.25,32.02 22.25,32.02 v2(23.84,32.02) 25.66,32.02 arc(25.98,32.09) 26.25,32.27 arc(26.33,32.39) 26.36,32.53 v2(26.36,35.53) ; v2(25.25,40.19) 25.65,40.19 arc(25.95,40.13) 26.21,39.96 arc(26.32,39.8) 26.36,39.61 v2(26.36,35.53)
TXD: length 8.7
  Top Layer w0.381: v2(25.63,18.25) 25.63,16.61 25.4,16.39 U3.43
  Bottom Layer w0.381: 20.37,18.48 20.58,18.27 P1.2 22.95,18.24 25.62,18.24 v2(25.63,18.25)
TXD2: length 4.7
  Top Layer w0.203: v2(2.76,14.34) 2.76,15.08 2.97,15.29 U3.27
  Bottom Layer w0.203: v2(2.76,14.34) 5.15,14.34 5.2,14.29 P2.2
USB_D_N: length 4.7
  Top Layer w0.203: J1.A7 13.53,8.62 13.65,8.73 14.53,8.73 ; J1.A7 14.53,8.73 ; 14.53,8.73 15.21,9.41 15.21,10.01
USB_D_P: length 6.2
  Top Layer w0.203: 16.22,10.01 16.22,9.59 15.03,8.39 J1.A6 15.03,6.54 14.91,6.42 14.15,6.42 14.03,6.54 J1.A6
USB_N: length 6.2
  Top Layer w0.203: U3.39 18.98,12.81 18.71,12.54 15.5,12.54 15.21,12.25 U4.6
USB_P: length 6.1
  Top Layer w0.203: U4.4 16.59,12.08 19.7,12.08 20.08,12.46 U3.40
V_BCKP: length 41.1
  Top Layer w0.381: v1(4.38,36.01) 4.42,36.05 4.93,36.05 BT2.1 6.14,37.26 arc(6.97,37.81) 7.94,38 R10.2
  Top Layer w0.508: v1(15.68,13.21) U3.36
  Power w0.381: v1(15.68,13.21) 14.73,14.16 5.18,14.16 4.38,14.96 v1(4.38,36.01)
  Bottom Layer w0.381: v1(4.38,36.01) 4.35,36.05 3.84,36.05 BT1.1
V_USB: length 16.1
  Top Layer w0.254: RT9013.5 25.22,10.73 C17.2 R12.1 v2(25.21,12.39) 26.13,13.3 26.92,13.3 USB-3.3V.1
  Top Layer w0.508: v1(17.88,13.21) U3.38
  Power w0.254: v2(25.21,12.39) 18.71,12.39 v1(17.88,13.21)
  Bottom Layer w0.508: v1(17.88,13.21) 17.87,13.2 17.87,11.4 C16.2

## Copper pours and planes (outline as drawn; the poured copper is in the pictures)
GND on Top Layer: 3.06,0 0.9,0.9 0,3.07 0,3.09 0,44.64 0.01,44.67 0,44.69 0.9,46.86 3.07,47.76 3.09,47.76 12.28,47.76 12.31,47.75 12.35,47.71 12.36,47.68 12.36,42.6 15.78,42.6 15.78,47.68 15.78,47.7 15.83,47.75 15.86,47.76 25.16,47.76 25.16,47.76 27.33,46.86 28.23,44.69 28.22,44.67 28.22,3.06 27.33,0.9 25.16,0 25.14,0 3.07,0
GND on Bottom Layer: 3.06,0 0.9,0.9 0,3.07 0,3.09 0,44.64 0.01,44.67 0,44.69 0.9,46.86 3.07,47.76 3.09,47.76 12.28,47.76 12.31,47.75 12.35,47.71 12.36,47.68 12.36,42.6 15.78,42.6 15.78,47.68 15.78,47.7 15.83,47.75 15.86,47.76 25.16,47.76 25.16,47.76 27.33,46.86 28.23,44.69 28.22,44.67 28.22,3.06 27.33,0.9 25.16,0 25.14,0 3.07,0
GND on Bottom Layer: 13.16,22.88 14.14,22.88 14.23,22.97 14.23,23.31 14.14,23.41 12.54,23.41 11.95,23.99 8.83,23.99 8.53,23.69 8.53,21.86 8.78,21.61 11.88,21.61 13.15,22.88
GND on GND: 3.06,0 0.9,0.9 0,3.07 0,3.09 0,44.64 0.01,44.67 0,44.69 0.9,46.86 3.07,47.76 3.09,47.76 12.28,47.76 12.31,47.75 12.35,47.71 12.36,47.68 12.36,42.6 15.78,42.6 15.78,47.68 15.78,47.7 15.83,47.75 15.86,47.76 25.16,47.76 25.16,47.76 27.33,46.86 28.23,44.69 28.22,44.67 28.22,3.06 27.33,0.9 25.16,0 25.14,0 3.07,0
GND on Power: 3.06,0 0.9,0.9 0,3.07 0,3.09 0,44.64 0.01,44.67 0,44.69 0.9,46.86 3.07,47.76 3.09,47.76 12.28,47.76 12.31,47.75 12.35,47.71 12.36,47.68 12.36,42.6 15.78,42.6 15.78,47.68 15.78,47.7 15.83,47.75 15.86,47.76 25.16,47.76 25.16,47.76 27.33,46.86 28.23,44.69 28.22,44.67 28.22,3.06 27.33,0.9 25.16,0 25.14,0 3.07,0
VBUS on Top Layer: 20.11,10.79 20.34,11.01 22.72,11.01 22.8,10.94 22.8,8.91 22.75,8.86 21.76,8.86 21.22,9.39 20.23,9.39 20.11,9.52
VCC_3V3 on Bottom Layer: 14.85,21.86 15.15,22.16 15.15,22.67 15.28,22.8 16.15,22.8 16.27,22.67 16.27,18.33 14.32,16.37 14.32,11.65 13.76,11.09 12.31,11.09 12.06,11.34 12.06,17.14 14.85,19.93
VCC_3V3 on Power: 12.26,12.84 12.26,11.55 12.44,11.37 13.81,11.37 13.96,11.52 13.96,12.87 13.88,12.94 12.36,12.94
VDD_3V3 on Bottom Layer: 15.27,22.92 15.27,23.27 15.33,23.33 16.35,23.33 16.55,23.54 16.55,25.42 16.93,25.8 18.05,25.8 18.3,25.54 18.3,23.1 18.13,22.93
VDD_5V_IN on Bottom Layer: 22.09,19.98 22.09,19.09 22.22,18.96 26.23,18.96 26.46,19.19 26.46,19.98 26.25,20.18 22.29,20.18
VDD_5V_IN on Bottom Layer: 13.38,22.8 12.49,21.91 11.93,21.35 8.8,21.35 8.19,20.74 8.19,14.29 7.64,13.73 4.33,13.73 3.88,13.27 3.88,12.26 4.13,12 9.49,12 9.9,12.41 9.9,18.3 10.71,19.12 12.41,19.12 13.38,20.08 13.38,20.92 13.83,21.38 14.16,21.38 14.37,21.58 14.37,22.62 14.19,22.8
VDD_5V_IN on Power: 9.34,20.36 9.34,19.07 9.54,18.86 26.25,18.86 26.44,19.05 26.44,20.05 25.95,20.54 9.52,20.54

## Text on the board
Top Silkscreen Layer: RTK | GEO | PPS | PWR
